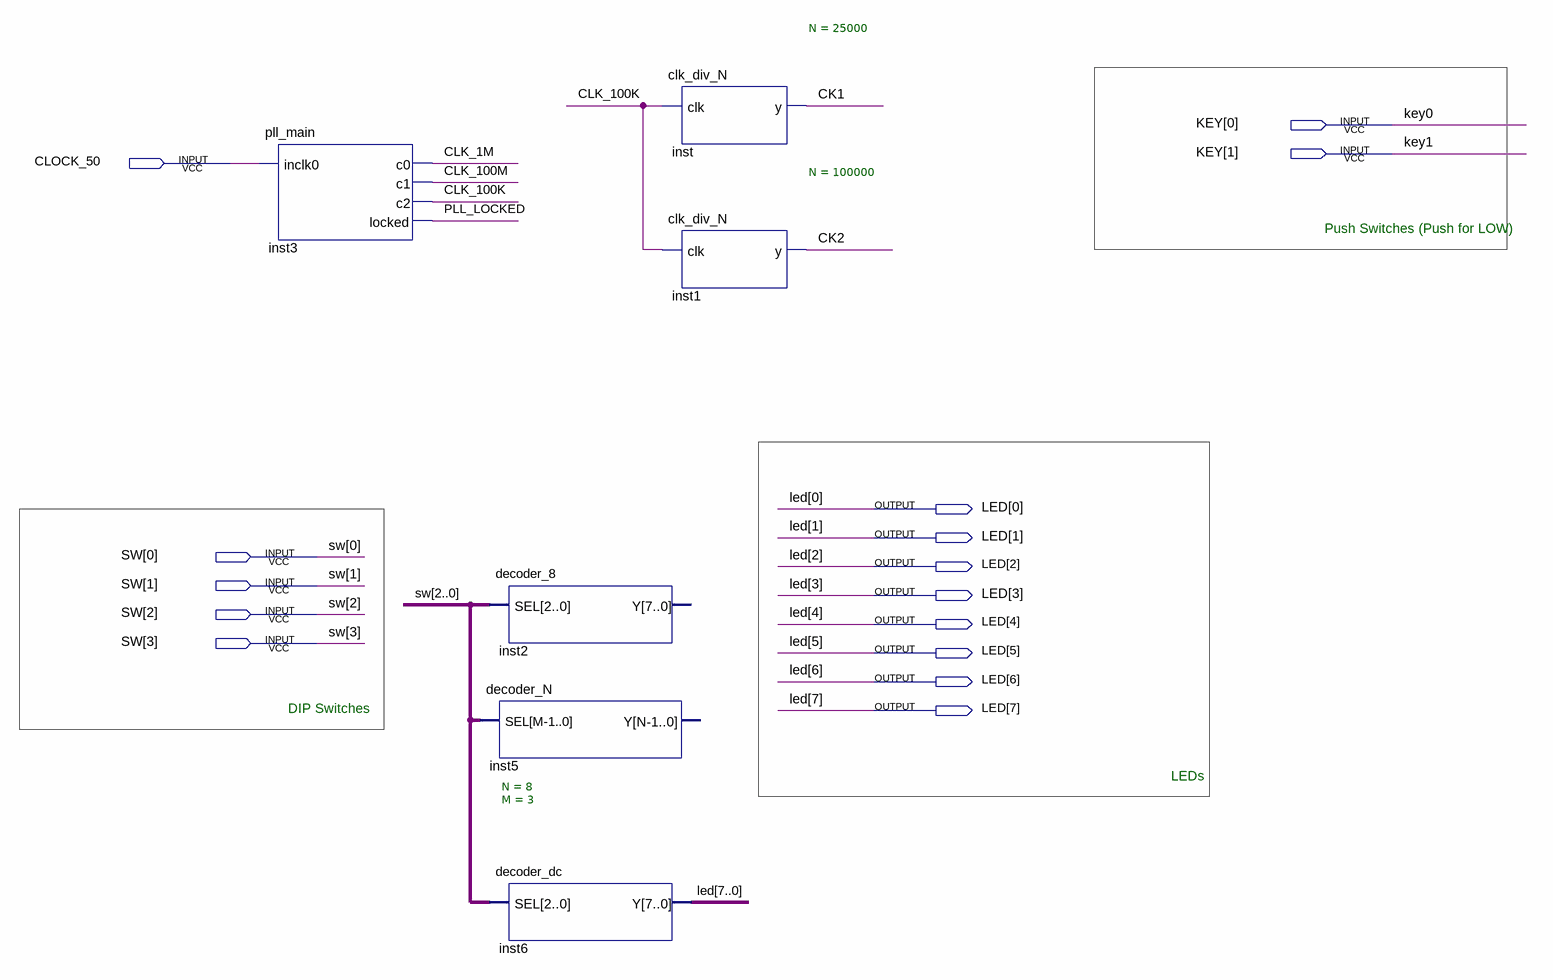
[diagram p0: schematic sheet]
// Quartus schematic TopLevelSchematic.bdf as structural Verilog: 6 symbols, 15 pins
module TopLevelSchematic (
  input  [1:0] KEY,
  input  CLOCK_50,
  input  [3:0] SW,
  output [7:0] LED
);

  wire CK1, CK2, CLK_1M, CLK_100K, CLK_100M, PLL_LOCKED;

  pll_main inst3 (.inclk0(CLOCK_50), .c0(CLK_1M), .c1(CLK_100M), .c2(CLK_100K), .locked(PLL_LOCKED));
  decoder_8 inst2 (.SEL(SW[2:0]));  // open: Y
  decoder_N #(.N(8), .M(3)) inst5 (.SEL(SW[2:0]));  // open: Y
  decoder_dc inst6 (.SEL(SW[2:0]), .Y(LED));
  clk_div_N #(.N(25000)) inst (.clk(CLK_100K), .y(CK1));
  clk_div_N #(.N(100000)) inst1 (.clk(CLK_100K), .y(CK2));

  // Notes on the sheet:
  //   Push Switches (Push for LOW)
  //   DIP Switches
  //   LEDs
endmodule
